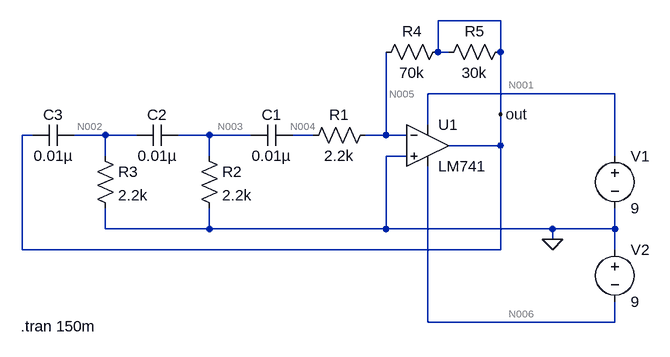
[diagram p0: schematic Draft2.asc]
Draft2.asc, the LTspice schematic file:
Version 4
SHEET 1 1016 680
WIRE 784 -64 688 -64
WIRE 688 -16 688 -64
WIRE 704 -16 688 -16
WIRE 784 -16 784 -64
WIRE 960 48 672 48
WIRE 784 80 784 -16
WIRE 672 96 672 48
WIRE 64 112 48 112
WIRE 176 112 128 112
WIRE 224 112 176 112
WIRE 336 112 288 112
WIRE 400 112 336 112
WIRE 496 112 464 112
WIRE 608 112 608 -16
WIRE 608 112 576 112
WIRE 640 112 608 112
WIRE 784 128 784 80
WIRE 784 128 704 128
WIRE 176 144 176 112
WIRE 336 144 336 112
WIRE 640 144 608 144
WIRE 960 144 960 48
WIRE 176 256 176 224
WIRE 336 256 336 224
WIRE 336 256 176 256
WIRE 608 256 608 144
WIRE 608 256 336 256
WIRE 864 256 608 256
WIRE 960 256 960 224
WIRE 960 256 864 256
WIRE 864 272 864 256
WIRE 48 288 48 112
WIRE 784 288 784 128
WIRE 784 288 48 288
WIRE 960 288 960 256
WIRE 672 400 672 160
WIRE 960 400 960 368
WIRE 960 400 672 400
FLAG 864 272 0
FLAG 784 80 out
SYMBOL OpAmps\\LM741 672 64 R0
SYMATTR InstName U1
SYMBOL res 592 96 R90
WINDOW 0 0 56 VBottom 2
WINDOW 3 32 56 VTop 2
SYMATTR InstName R1
SYMATTR Value 2.2k
SYMBOL cap 464 96 R90
WINDOW 0 0 32 VBottom 2
WINDOW 3 32 32 VTop 2
SYMATTR InstName C1
SYMATTR Value 0.01µ
SYMBOL res 320 128 R0
SYMATTR InstName R2
SYMATTR Value 2.2k
SYMBOL res 160 128 R0
SYMATTR InstName R3
SYMATTR Value 2.2k
SYMBOL cap 288 96 R90
WINDOW 0 0 32 VBottom 2
WINDOW 3 32 32 VTop 2
SYMATTR InstName C2
SYMATTR Value 0.01µ
SYMBOL cap 128 96 R90
WINDOW 0 0 32 VBottom 2
WINDOW 3 32 32 VTop 2
SYMATTR InstName C3
SYMATTR Value 0.01µ
SYMBOL res 704 -32 R90
WINDOW 0 0 56 VBottom 2
WINDOW 3 32 56 VTop 2
SYMATTR InstName R4
SYMATTR Value 70k
SYMBOL res 800 -32 R90
WINDOW 0 0 56 VBottom 2
WINDOW 3 32 56 VTop 2
SYMATTR InstName R5
SYMATTR Value 30k
SYMBOL voltage 960 128 R0
WINDOW 123 0 0 Left 0
WINDOW 39 0 0 Left 0
SYMATTR InstName V1
SYMATTR Value 9
SYMBOL voltage 960 272 R0
WINDOW 123 0 0 Left 0
WINDOW 39 0 0 Left 0
SYMATTR InstName V2
SYMATTR Value 9
TEXT 46 406 Left 2 !.tran 150m

The netlist it stands for:
* Draft2.asc
XU1 0 N005 N001 N006 out LM741  ; pins In+ In- V+ V- OUT
R1 N005 N004 2.2k
C1 N004 N003 0.01µ
R2 N003 0 2.2k
R3 N002 0 2.2k
C2 N003 N002 0.01µ
C3 N002 out 0.01µ
R4 out N005 70k
R5 out out 30k
V1 N001 0 9
V2 0 N006 9
.tran 150m
.lib LM741.lib
.backanno
.end

* Results of the author's LTspice run, read from the files saved beside the schematic
* Operating Point, zero values left out:
*   V(n005) = 1 mV
*   V(n006) = -9 V
*   V(n001) = 9 V
*   V(out) = 8.13 mV
*   V(n004) = 1 mV
*   I(R4) = 101.9 nA
*   I(V1) = -1.551 mA
*   I(V2) = -1.551 mA
*   Ix(u1:1) = 57.86 nA
*   Ix(u1:2) = 101.9 nA
*   Ix(u1:99) = 1.551 mA
*   Ix(u1:50) = -1.551 mA
*   Ix(u1:28) = -101.9 nA
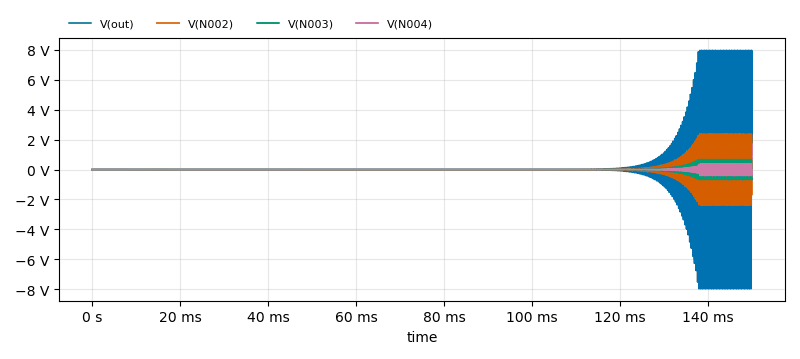
[diagram p1: Transient Analysis of Draft2.asc, plotted from the saved traces]
* Transient Analysis, 1 run:
*   V(out): min -7.974 V, max 7.975 V, average 10.84 mV, rms 1.752 V, last 1.813 V
*   V(N002): min -2.388 V, max 2.393 V, average 618.7 µV, rms 513.9 mV, last -1.662 V
*   V(N003): min -672.4 mV, max 670.9 mV, average -46.14 µV, rms 147.6 mV, last -672.3 mV
*   V(N004): min -407.4 mV, max 397.8 mV, average 846.2 µV, rms 61.05 mV, last -30.87 mV